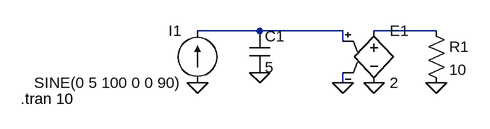
[diagram p0: schematic Draft4.asc]
Draft4.asc, the LTspice schematic file:
Version 4
SHEET 1 880 680
WIRE 32 -112 -64 -112
WIRE 160 -112 32 -112
WIRE 304 -112 208 -112
WIRE 160 -96 160 -112
WIRE 160 -32 160 -48
FLAG -64 -32 0
FLAG 32 -48 0
FLAG 160 -32 0
FLAG 208 -32 0
FLAG 304 -32 0
SYMBOL current -64 -32 R180
WINDOW 0 24 80 Left 2
WINDOW 3 24 0 Left 2
WINDOW 123 0 0 Left 0
WINDOW 39 0 0 Left 0
SYMATTR InstName I1
SYMATTR Value SINE(0 5 100 0 0 90)
SYMBOL cap 16 -112 R0
SYMATTR InstName C1
SYMATTR Value 5
SYMBOL e 208 -128 R0
SYMATTR InstName E1
SYMATTR Value 2
SYMBOL res 288 -128 R0
SYMATTR InstName R1
SYMATTR Value 10
TEXT -336 -8 Left 2 !.tran 10

The netlist it stands for:
* Draft4.asc
I1 0 N001 SINE(0 5 100 0 0 90)
C1 N001 0 5
E1 N002 0 N001 0 2
R1 N002 0 10
.tran 10
.backanno
.end